# Altium schematic sheet S7CAS-PLEIADES-CARTE-MERE_P20_DDR3.SchDoc
size Tabloid; Sheet_Name: DDR3; Size: 11x17
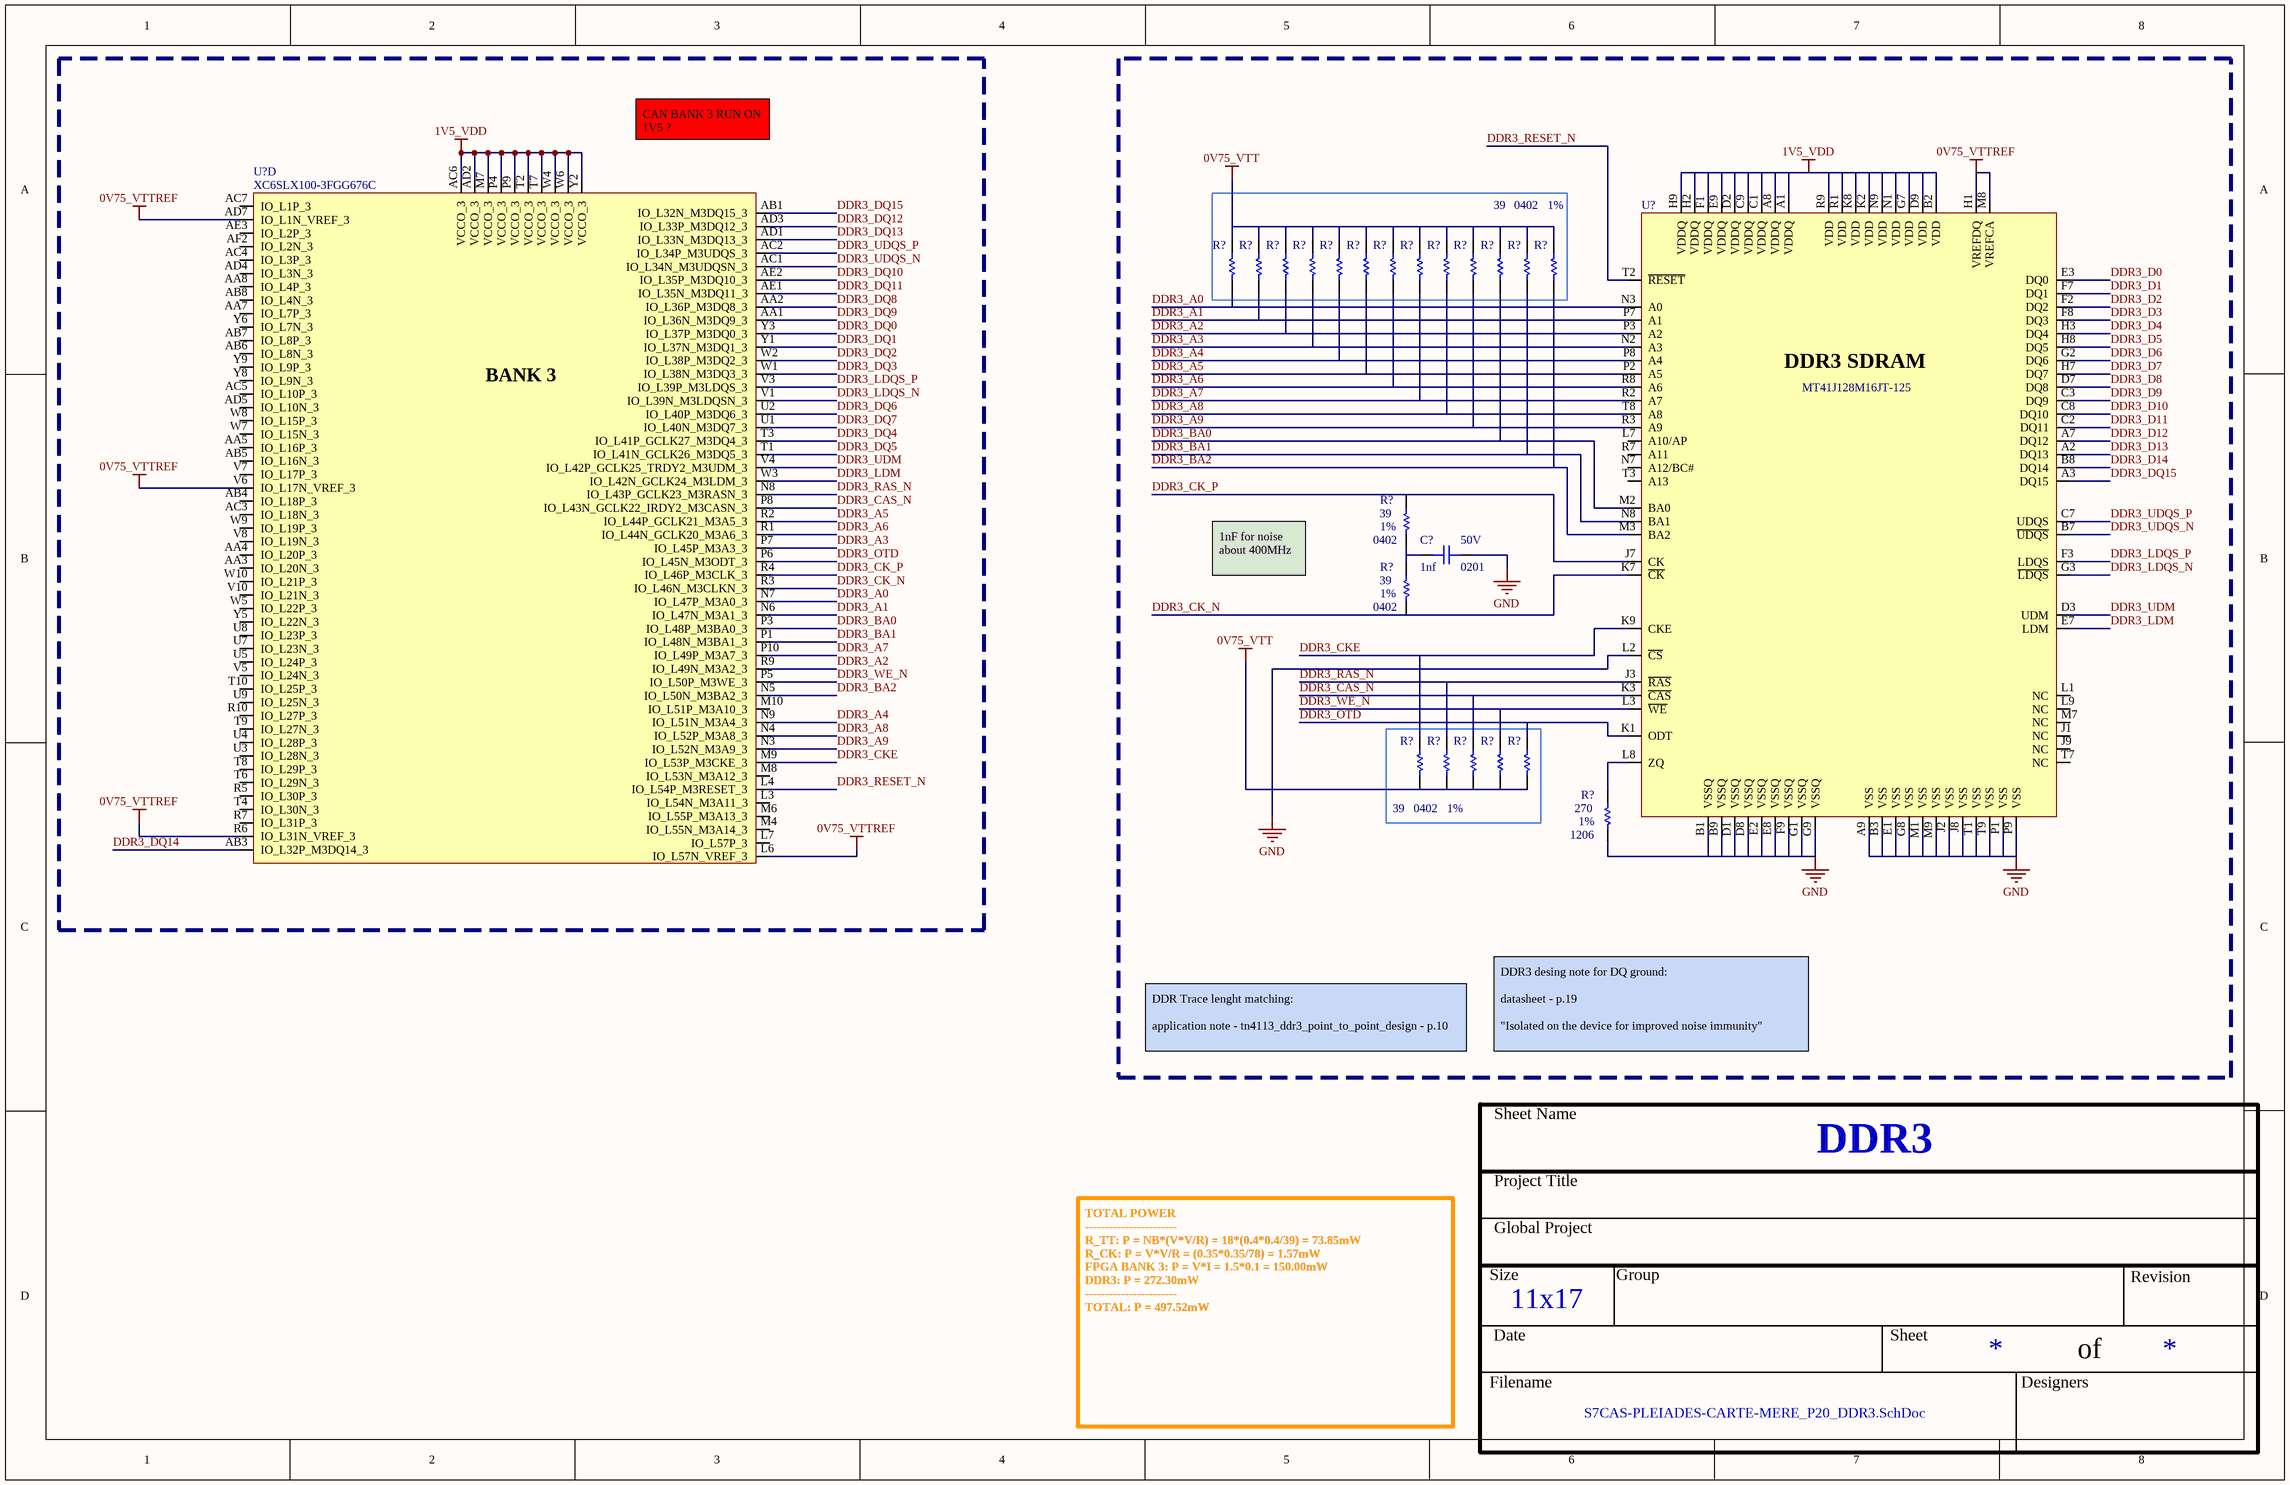
[diagram p0: S7CAS-PLEIADES-CARTE-MERE_P20_DDR3.SchDoc]

## Parts
(Parts that share a designator on the sheet are numbered #1, #2 ... from top to bottom, then left to right.)
C?  value 1nf  Voltage: 50V  Package: 0201  [CAP_0201]  (hidden comment: CAP - 0201)
R?#1  value 39  Package: 0402  Precision: 1%  [RES_0402]  (hidden comment: RES - 0402)
R?#2  RES - 0402  [RES_0402]  (value not drawn)
R?#3  RES - 0402  [RES_0402]  (value not drawn)
R?#4  RES - 0402  [RES_0402]  (value not drawn)
R?#5  RES - 0402  [RES_0402]  (value not drawn)
R?#6  RES - 0402  [RES_0402]  (value not drawn)
R?#7  RES - 0402  [RES_0402]  (value not drawn)
R?#8  RES - 0402  [RES_0402]  (value not drawn)
R?#9  RES - 0402  [RES_0402]  (value not drawn)
R?#10  RES - 0402  [RES_0402]  (value not drawn)
R?#11  RES - 0402  [RES_0402]  (value not drawn)
R?#12  RES - 0402  [RES_0402]  (value not drawn)
R?#13  RES - 0402  [RES_0402]  (value not drawn)
R?#14  value 39  Package: 0402  Precision: 1%  [RES_0402]  (hidden comment: RES - 0402)
R?#15  value 39  Package: 0402  Precision: 1%  [RES_0402]  (hidden comment: RES - 0402)
R?#16  value 39  Package: 0402  Precision: 1%  [RES_0402]  (hidden comment: RES - 0402)
R?#17  RES - 0402  [RES_0402]  (value not drawn)
R?#18  RES - 0402  [RES_0402]  (value not drawn)
R?#19  RES - 0402  [RES_0402]  (value not drawn)
R?#20  RES - 0402  [RES_0402]  (value not drawn)
R?#21  value 270  Package: 1206  Precision: 1%  [RES_0402]  (hidden comment: RES - 0402)
U?#1  XC6SLX100-3FGG676C  [FPGA_XILINX_FGG676]  (part D of 10)
U?#2  MT41J128M16JT-125  [MEM_DDR3_MT41J128M16JT-125]

## Nets
0V75_VTT: R?#1.2 R?#2.2 R?#3.2 R?#4.2 R?#5.2 R?#6.2 R?#7.2 R?#8.2 R?#9.2 R?#10.2 R?#11.2 R?#12.2 R?#13.2 R?#16.1 R?#17.1 R?#18.1 R?#19.1 R?#20.1
0V75_VTTREF: U?#1.AD7(IO_L1N_VREF_3) U?#1.L6(IO_L57N_VREF_3) U?#1.R6(IO_L31N_VREF_3) U?#1.V6(IO_L17N_VREF_3) U?#2.H1(VREFDQ) U?#2.M8(VREFCA)
1V5_VDD: U?#1.AC6(VCCO_3) U?#1.AD2(VCCO_3) U?#1.M7(VCCO_3) U?#1.P4(VCCO_3) U?#1.P9(VCCO_3) U?#1.T2(VCCO_3) U?#1.T7(VCCO_3) U?#1.W4(VCCO_3) U?#1.W6(VCCO_3) U?#1.Y2(VCCO_3) U?#2.A1(VDDQ) U?#2.A8(VDDQ) U?#2.B2(VDD) U?#2.C1(VDDQ) U?#2.C9(VDDQ) U?#2.D2(VDDQ) U?#2.D9(VDD) U?#2.E9(VDDQ) U?#2.F1(VDDQ) U?#2.G7(VDD) U?#2.H2(VDDQ) U?#2.H9(VDDQ) U?#2.K2(VDD) U?#2.K8(VDD) U?#2.N1(VDD) U?#2.N9(VDD) U?#2.R1(VDD) U?#2.R9(VDD)
GND: C?.1 R?#21.1 U?#2.A9(VSS) U?#2.B1(VSSQ) U?#2.B3(VSS) U?#2.B9(VSSQ) U?#2.D1(VSSQ) U?#2.D8(VSSQ) U?#2.E1(VSS) U?#2.E2(VSSQ) U?#2.E8(VSSQ) U?#2.F9(VSSQ) U?#2.G1(VSSQ) U?#2.G8(VSS) U?#2.G9(VSSQ) U?#2.J2(VSS) U?#2.J8(VSS) U?#2.L2(~{CS}) U?#2.M1(VSS) U?#2.M9(VSS) U?#2.P1(VSS) U?#2.P9(VSS) U?#2.T1(VSS) U?#2.T9(VSS)
DDR3_A0: R?#1.1 U?#1.N7(IO_L47P_M3A0_3) U?#2.N3(A0)
DDR3_A1: R?#2.1 U?#1.N6(IO_L47N_M3A1_3) U?#2.P7(A1)
DDR3_A2: R?#3.1 U?#1.R9(IO_L49N_M3A2_3) U?#2.P3(A2)
DDR3_A3: R?#4.1 U?#1.P7(IO_L45P_M3A3_3) U?#2.N2(A3)
DDR3_A4: R?#5.1 U?#1.N9(IO_L51N_M3A4_3) U?#2.P8(A4)
DDR3_A5: R?#6.1 U?#1.R2(IO_L44P_GCLK21_M3A5_3) U?#2.P2(A5)
DDR3_A6: R?#7.1 U?#1.R1(IO_L44N_GCLK20_M3A6_3) U?#2.R8(A6)
DDR3_A7: R?#8.1 U?#1.P10(IO_L49P_M3A7_3) U?#2.R2(A7)
DDR3_A8: R?#9.1 U?#1.N4(IO_L52P_M3A8_3) U?#2.T8(A8)
DDR3_A9: R?#10.1 U?#1.N3(IO_L52N_M3A9_3) U?#2.R3(A9)
DDR3_BA0: R?#11.1 U?#1.P3(IO_L48P_M3BA0_3) U?#2.M2(BA0)
DDR3_BA1: R?#12.1 U?#1.P1(IO_L48N_M3BA1_3) U?#2.N8(BA1)
DDR3_BA2: R?#13.1 U?#1.N5(IO_L50N_M3BA2_3) U?#2.M3(BA2)
DDR3_CAS_N: R?#18.2 U?#1.P8(IO_L43N_GCLK22_IRDY2_M3CASN_3) U?#2.K3(~{CAS})
DDR3_CK_N: R?#15.1 U?#1.R3(IO_L46N_M3CLKN_3) U?#2.K7(~{CK})
DDR3_CK_P: R?#14.2 U?#1.R4(IO_L46P_M3CLK_3) U?#2.J7(CK)
DDR3_CKE: R?#16.2 U?#1.M9(IO_L53P_M3CKE_3) U?#2.K9(CKE)
DDR3_D0: U?#2.E3(DQ0)
DDR3_D1: U?#2.F7(DQ1)
DDR3_D2: U?#2.F2(DQ2)
DDR3_D3: U?#2.F8(DQ3)
DDR3_D4: U?#2.H3(DQ4)
DDR3_D5: U?#2.H8(DQ5)
DDR3_D6: U?#2.G2(DQ6)
DDR3_D7: U?#2.H7(DQ7)
DDR3_D8: U?#2.D7(DQ8)
DDR3_D9: U?#2.C3(DQ9)
DDR3_D10: U?#2.C8(DQ10)
DDR3_D11: U?#2.C2(DQ11)
DDR3_D12: U?#2.A7(DQ12)
DDR3_D13: U?#2.A2(DQ13)
DDR3_D14: U?#2.B8(DQ14)
DDR3_DQ0: U?#1.Y3(IO_L37P_M3DQ0_3)
DDR3_DQ1: U?#1.Y1(IO_L37N_M3DQ1_3)
DDR3_DQ2: U?#1.W2(IO_L38P_M3DQ2_3)
DDR3_DQ3: U?#1.W1(IO_L38N_M3DQ3_3)
DDR3_DQ4: U?#1.T3(IO_L41P_GCLK27_M3DQ4_3)
DDR3_DQ5: U?#1.T1(IO_L41N_GCLK26_M3DQ5_3)
DDR3_DQ6: U?#1.U2(IO_L40P_M3DQ6_3)
DDR3_DQ7: U?#1.U1(IO_L40N_M3DQ7_3)
DDR3_DQ8: U?#1.AA2(IO_L36P_M3DQ8_3)
DDR3_DQ9: U?#1.AA1(IO_L36N_M3DQ9_3)
DDR3_DQ10: U?#1.AE2(IO_L35P_M3DQ10_3)
DDR3_DQ11: U?#1.AE1(IO_L35N_M3DQ11_3)
DDR3_DQ12: U?#1.AD3(IO_L33P_M3DQ12_3)
DDR3_DQ13: U?#1.AD1(IO_L33N_M3DQ13_3)
DDR3_DQ14: U?#1.AB3(IO_L32P_M3DQ14_3)
DDR3_DQ15: U?#1.AB1(IO_L32N_M3DQ15_3) U?#2.A3(DQ15)
DDR3_LDM: U?#1.W3(IO_L42N_GCLK24_M3LDM_3) U?#2.E7(LDM)
DDR3_LDQS_N: U?#1.V1(IO_L39N_M3LDQSN_3) U?#2.G3(~{LDQS})
DDR3_LDQS_P: U?#1.V3(IO_L39P_M3LDQS_3) U?#2.F3(LDQS)
DDR3_OTD: R?#20.2 U?#1.P6(IO_L45N_M3ODT_3) U?#2.K1(ODT)
DDR3_RAS_N: R?#17.2 U?#1.N8(IO_L43P_GCLK23_M3RASN_3) U?#2.J3(~{RAS})
DDR3_RESET_N: U?#1.L4(IO_L54P_M3RESET_3) U?#2.T2(~{RESET})
DDR3_UDM: U?#1.V4(IO_L42P_GCLK25_TRDY2_M3UDM_3) U?#2.D3(UDM)
DDR3_UDQS_N: U?#1.AC1(IO_L34N_M3UDQSN_3) U?#2.B7(~{UDQS})
DDR3_UDQS_P: U?#1.AC2(IO_L34P_M3UDQS_3) U?#2.C7(UDQS)
DDR3_WE_N: R?#19.2 U?#1.P5(IO_L50P_M3WE_3) U?#2.L3(~{WE})
NetC?_2: C?.2 R?#14.1 R?#15.2
NetR?#21_2: R?#21.2 U?#2.L8(ZQ)

Not connected (* = marked no-connect by the designer): U?#1 AA3(IO_L20N_3) AA4(IO_L20P_3) AA5(IO_L16P_3) AA7(IO_L7P_3) AA8(IO_L4P_3) AB4(IO_L18P_3) AB5(IO_L16N_3) AB6(IO_L8N_3) AB7(IO_L8P_3) AB8(IO_L4N_3) AC3(IO_L18N_3) AC4(IO_L3P_3) AC5(IO_L10P_3) AC7(IO_L1P_3) AD4(IO_L3N_3) AD5(IO_L10N_3) AE3(IO_L2P_3) AF2(IO_L2N_3) L3(IO_L54N_M3A11_3) L7(IO_L57P_3) M4(IO_L55N_M3A14_3) M6(IO_L55P_M3A13_3) M8(IO_L53N_M3A12_3) M10(IO_L51P_M3A10_3) R5(IO_L30P_3) R7(IO_L31P_3) R10(IO_L27P_3) T4(IO_L30N_3) T6(IO_L29N_3) T8(IO_L29P_3) T9(IO_L27N_3) T10(IO_L25P_3) U3(IO_L28N_3) U4(IO_L28P_3) U5(IO_L24P_3) U7(IO_L23N_3) U8(IO_L23P_3) U9(IO_L25N_3) V5(IO_L24N_3) V7(IO_L17P_3) V8(IO_L19N_3) V10(IO_L21N_3) W5(IO_L22P_3) W7(IO_L15N_3) W8(IO_L15P_3) W9(IO_L19P_3) W10(IO_L21P_3) Y5(IO_L22N_3) Y6(IO_L7N_3) Y8(IO_L9N_3) Y9(IO_L9P_3); U?#2 J1(NC) J9(NC) L1(NC) L7(A10/AP) L9(NC) M7(NC) N7(A12/BC#) R7(A11) T3(A13) T7(NC)

## Notes on the sheet
- CAN BANK 3 RUN ON 1V5 ?
- 1nF for noise about 400MHz
- DDR Trace lenght matching:
  application note - tn4113_ddr3_point_to_point_design - p.10
- DDR3 desing note for DQ ground:
  datasheet - p.19
  "Isolated on the device for improved noise immunity"
- TOTAL POWER
  -----------------------
  R_TT: P = NB*(V*V/R) = 18*(0.4*0.4/39) = 73.85mW
  R_CK: P = V*V/R = (0.35*0.35/78) = 1.57mW
  FPGA BANK 3: P = V*I = 1.5*0.1 = 150.00mW
  DDR3: P = 272.30mW
  -----------------------
  TOTAL: P = 497.52mW
- Sheet Name
- Project Title
- Global Project
- Size
- Group
- Revision
- Date
- Sheet
- of
- Filename
- Designers
- (in symbol FPGA_XC6SLX100-3FGG676C, part D) BANK 3
- (in symbol MEM_DDR3_MT41J128M16JT-125:K TR) DDR3 SDRAM

## Library data of the parts
C? = CAP - 0201: Mfg Part Number: GRM0335C1H102JE01; Precision: 10%; Current: *; CreatedBy: Jonathan Bouchard; Power: *
R?#1 = RES - 0402: Mfg Part Number: RL0510S-390-F; Voltage: 50V; Power: 1/16W; Current: *; CreatedBy: Jonathan Bouchard
R?#2-R?#13 = RES - 0402: Mfg Part Number: RL0510S-390-F; Voltage: 50V; Power: 1/16W; Precision: 1%; Value: 39; Current: *; CreatedBy: Jonathan Bouchard; Package: 0402
R?#14-R?#16 = RES - 0402: Mfg Part Number: RL0510S-390-F; Voltage: 50; Power: 1/16W; Current: *; CreatedBy: Jonathan Bouchard
R?#17-R?#20 = RES - 0402: Mfg Part Number: RL0510S-390-F; Voltage: 50; Power: 1/16W; Precision: 1%; Value: 39; Current: *; CreatedBy: Jonathan Bouchard; Package: 0402
R?#21 = RES - 0402: Mfg Part Number: CRM1206-FX-2700ELF; Voltage: 50V; Power: 1/2W; Current: *; CreatedBy: Jonathan Bouchard
U?#1 = FPGA_XC6SLX100-3FGG676C: FPGA - XILINX SPARTAN 6 480 I/O - BGA-676; Voltage: 1.14 V ~ 1.26 V; Current: *; Power: *; Mfg: Xilinx; Mfg Part Number: XC6SLX100-3FGG676C; HelpURL: https://www.xilinx.com/support/documentation/data_sheets/ds162.pdf; CreatedBy: Jonathan Bouchard; Temperature: 0°C ~ 85°C (TJ); Value: *; Precision: *; Package: BGA-676; Supplier 1: Digikey; Supplier Part Number 1: 122-1760-ND
U?#2 = MEM_DDR3_MT41J128M16JT-125:K TR: MEM - DDR3 SDRAM 2GBIT 800MHZ - TFBGA-96; Voltage: 1.425 V ~ 1.575 V; Mfg: Micrel; Current: *; Power: *; Mfg Part Number: MT41J128M16JT-125; HelpURL: http://www.micron.com/~/media/Documents/Products/Data%20Sheet/DRAM/DDR3/2Gb_DDR3_SDRAM.pdf; CreatedBy: Jonathan Bouchard; Temperature: 0°C ~ 95°C (TC); Value: *; Precision: *; Package: TFBGA-96; Supplier 1: Digikey; Supplier Part Number 1: 557-1611-1-ND